# EAGLE design CurrentSensor (EAGLE 9.3.2)
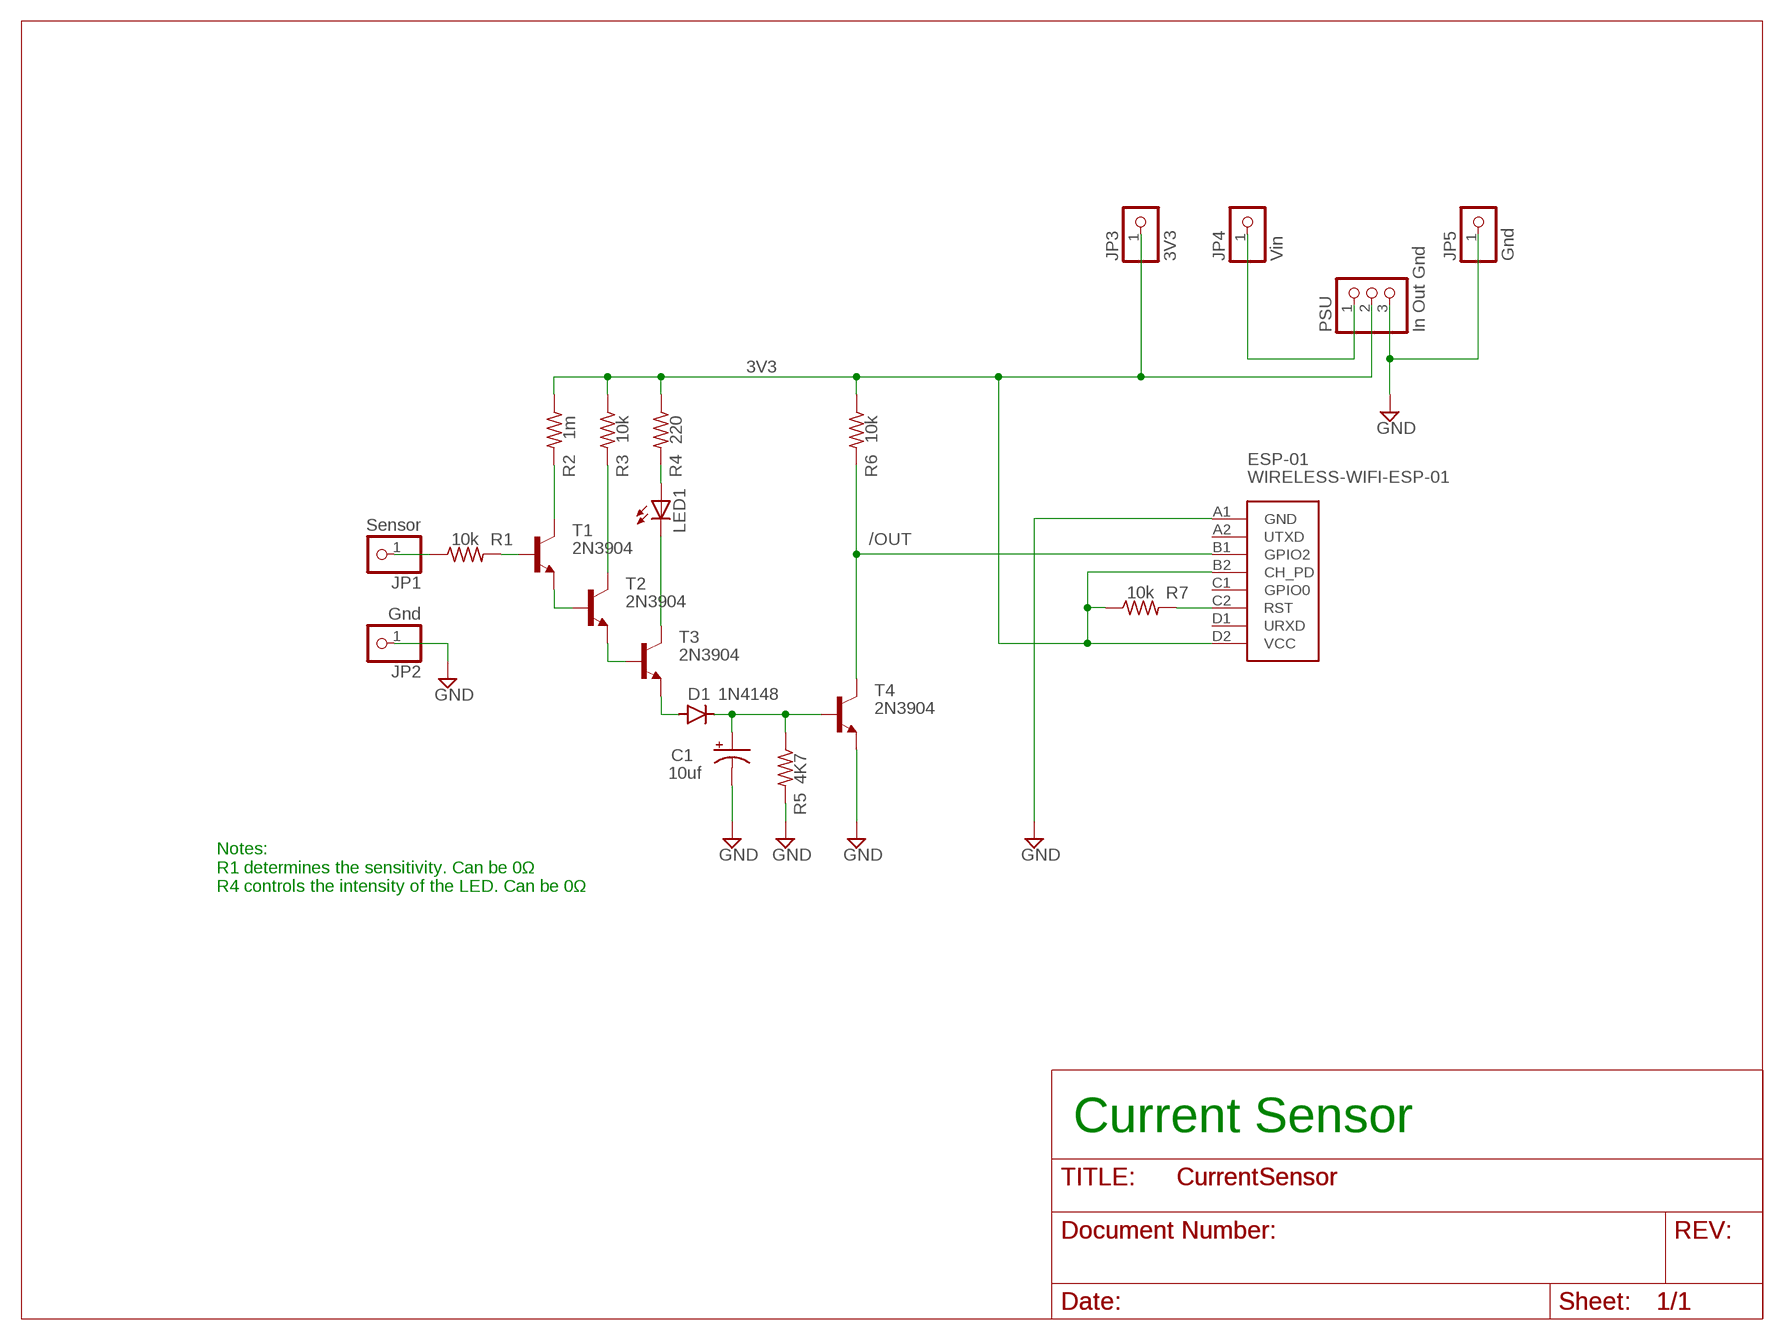
[diagram p0: schematic, sheet 1]

## Parts
C1  10uf  CPOL-USE15-5AXIAL  [E15-5]
D1  1N4148  1N4148DO35-10  [DO35-10]
ESP-01  WIRELESS-WIFI-ESP-01  [WIRELESS-WIFI-ESP-01]
JP1  Sensor  PINHD-1X1  [1X01]
JP2  Gnd  PINHD-1X1  [1X01]
JP3  3V3  PINHD-1X1CB  [1X01-CLEANBIG]
JP4  Vin  PINHD-1X1CB  [1X01-CLEANBIG]
JP5  Gnd  PINHD-1X1CB  [1X01-CLEANBIG]
LED1  LED5MM  [LED5MM]
PSU  In Out Gnd  PINHD-1X3CB  [1X03-CLEANBIG]
R1  10k  R-US_0207/9  [0207/9]
R2  1m  R-US_0207/9  [0207/9]
R3  10k  R-US_0207/9  [0207/9]
R4  220  R-US_0207/9  [0207/9]
R5  4K7  R-US_0207/9  [0207/9]
R6  10k  R-US_0207/9  [0207/9]
R7  10k  R-US_0207/9  [0207/9]
T1  2N3904  [TO92]
T2  2N3904  [TO92]
T3  2N3904  [TO92]
T4  2N3904  [TO92]

## Nets
3V3: ESP-01.B2(CH_PD) ESP-01.D2(VCC) JP3.1 PSU.2 R2.1 R3.1 R4.1 R6.1 R7.1
/OUT: ESP-01.B1(GPIO2) R6.2 T4.1(C)
GND: C1.- ESP-01.A1(GND) JP2.1 JP5.1 PSU.3 R5.2 T4.3(E)
N$1: JP4.1 PSU.1
N$3: JP1.1 R1.1
N$5: T1.3(E) T2.2(B)
N$8: T2.3(E) T3.2(B)
N$9: D1.A T3.3(E)
N$10: C1.+ D1.C R5.1 T4.2(B)
N$11: LED1.K(C) T3.1(C)
N$12: LED1.A R4.2
N$13: R3.2 T2.1(C)
N$14: R2.2 T1.1(C)
N$15: R1.2 T1.2(B)
N$17: ESP-01.C2(RST) R7.2
Unconnected: ESP-01.A2(UTXD) ESP-01.C1(GPIO0) ESP-01.D1(URXD)

## Notes on the sheet
- Notes:
  R1 determines the sensitivity. Can be 0Ω
  R4 controls the intensity of the LED. Can be 0Ω
- Current Sensor

## Library data of the parts
C1 = adafruit:CPOL-US: POLARIZED CAPACITOR, American symbol
D1 = diode:1N4148: DIODE high speed (Philips)
ESP-01 = myParts:WIRELESS-WIFI-ESP-01: Wireless Wi-Fi ESP-01 Module based on ESP8266 chip Click here to find device on ebay.com <http://www.ebay.com/sch/esp8266+esp+01+transceiver>
JP1-JP5 = adafruit:PINHD-1X1: Pin header 1x1 for 0.1" spacing With round pins
LED1 = adafruit:LED: LED OSRAM: - CHIPLED LG R971, LG N971, LY N971, LG Q971, LY Q971, LO R971, LY R971 LH N974, LH R974 LS Q976, LO Q976, LY Q976 LO Q996 - Hyper CHIPLED LW Q18S LB Q993, LB Q99A, LB R99A - SideLED LS A670, LO A670, LY A670, LG A670, LP A670 LB A673, LV A673, LT A673, LW A673 LH A674 LY A675 LS A676, LA A676, LO A676, LY A676, LW A676 LS A679, LY A679, LG A679 - Hyper Micro SIDELED® LS Y876, LA Y876, LO Y876, LY Y876 LT Y87S - SmartLED LW L88C, LW L88S LB L89C, LB L89S, LG L890 LS L89K, LO L89K, LY L89K LS L896, LA L896, LO L896, LY L896 - TOPLED LS T670, LO T670, LY T670, LG T670, LP T670 LSG T670, LSP T670, LSY T670, LOP T670, LYG T670 LG T671, LOG T671, LSG T671 LB T673, LV T673, LT T673, LW T673 LH T674 LS T676, LA T676, LO T676, LY T676, LB T676, LH T676, LSB T676, LW T676 LB T67C, LV T67C, LT T67C, LS T67K, LO T67K, LY T67K, LW E67C LS E67B, LA E67B, LO E67B, LY E67B, LB E67C, LV E67C, LT E67C LW T67C LS T679, LY T679, LG T679 LS T770, LO T770, LY T770, LG T770, LP T770 LB T773, LV T773, LT T773, LW T773 LH T774 LS E675, LA E675, LY E675, LS T675 LS T776, LA T776, LO T776, LY T776, LB T776 LHGB T686 LT T68C, LB T68C - Hyper Mini TOPLED® LB M676 - Mini TOPLED Santana® LG M470 LS M47K, LO M47K, LY M47K Source: http://www.osram.convergy.de/
PSU = adafruit:PINHD-1X3: PIN HEADER
R1-R7 = adafruit:R-US_: RESISTOR, American symbol
T1-T4 = transistor:2N3904: NPN TRANSISTOR

## Board
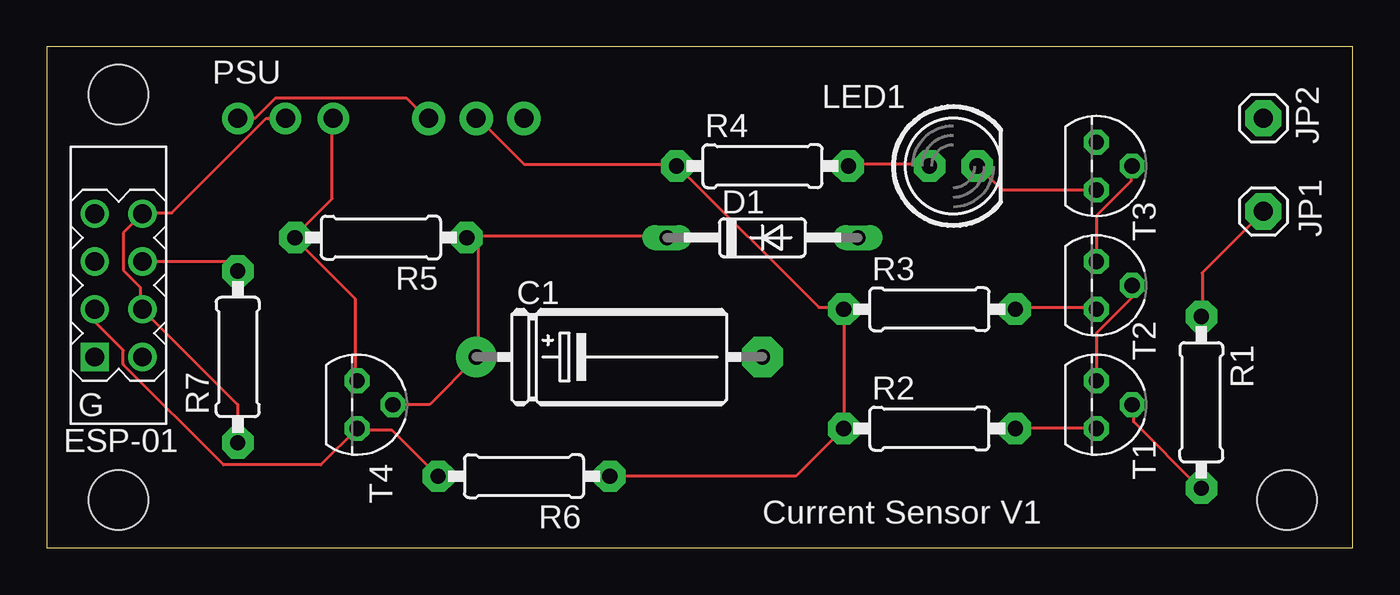
[diagram p1: board, top side]
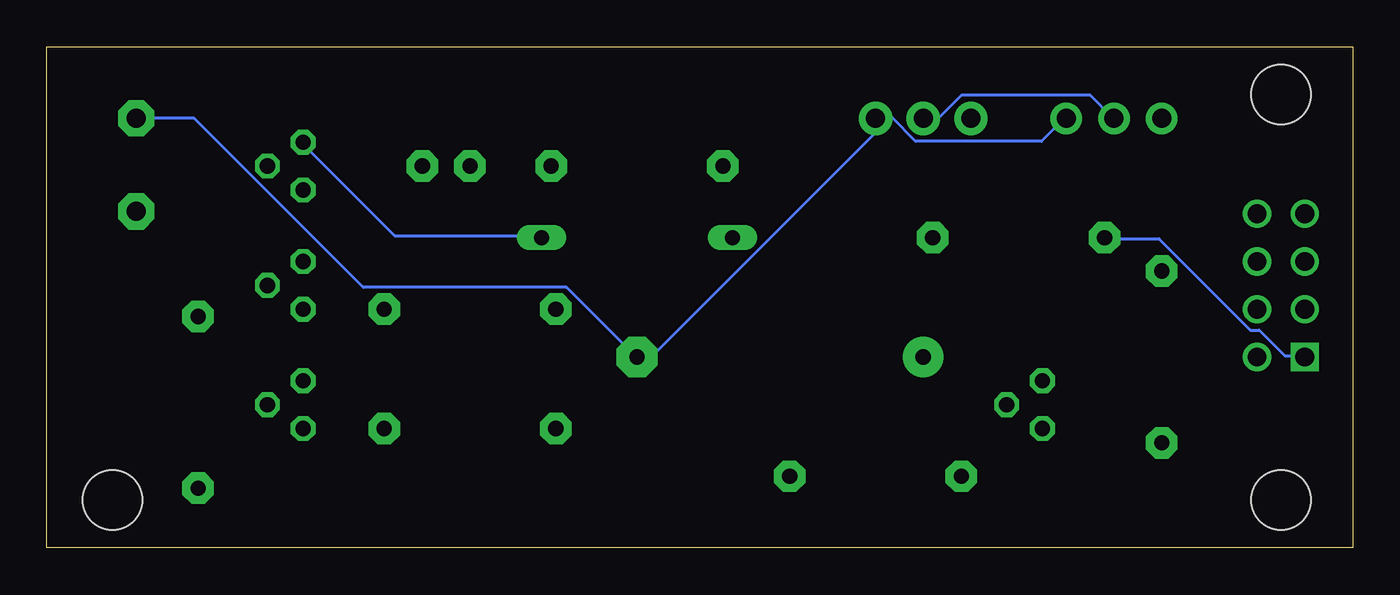
[diagram p2: board, bottom side, seen from below]

Size 69.52 x 26.66 mm. Coordinates in mm from the lower left corner, seen from the top.
Outline: 0,0 69.52,0 69.52,26.66 0,26.66 0,0
Copper layers (1*16): Top 0.035mm / dielectric 1.5mm / Bottom 0.035mm
Design rules "default": minimum track width 6mil, minimum drill 0.35mm, track to track 6mil, track to pad 6mil, pad to pad 6mil, via to via 6mil, smd to smd 6mil, copper to edge 40mil, drill to drill 6mil, minimum pad ring 10mil, minimum via ring 8mil, stop-mask expansion 4mil, vias tented up to drill 0mil, thermal gap 10mil
Holes 3.17 mm at 3.81,24.13 3.81,2.54 66.04,2.54

### Footprints (pad centres in the part's own frame; a part is rotated, then mirrored left to right if it is on the bottom)
E15-5 = drill 0.813 pad 2.159: + -7.62,0 | drill 0.813 pad 2.159 octagon: - 7.62,0
DO35-10 = drill 0.813 long: A 5.08,0; C -5.08,0
WIRELESS-WIFI-ESP-01 = drill 1 square: A1 1.27,3.81 | drill 1: A2 -1.27,3.81; B1 1.27,1.27; B2 -1.27,1.27; C1 1.27,-1.27; C2 -1.27,-1.27; D1 1.27,-3.81; D2 -1.27,-3.81
1X01 = drill 1.016 pad 1.93 octagon: 1 0,0
1X01-CLEANBIG = drill 1.016 pad 1.778: 1 0,0
LED5MM = drill 0.813 pad 1.676 octagon: A -1.27,0; K 1.27,0
1X03-CLEANBIG = drill 1.016 pad 1.676: 1 -2.54,0; 2 0,0; 3 2.54,0
0207/9 = drill 0.813 pad 1.676 octagon: 1 -4.572,0; 2 4.572,0
TO92 = drill 0.813 octagon: 1 1.27,0; 2 0,1.905; 3 -1.27,0

### Placement (x,y rotation side)
C1  30.48,10.16 0 top
D1  38.1,16.51 0 top
ESP-01  3.81,13.97 180 top
JP1  64.77,17.91 0 top
JP2  64.77,22.86 0 top
JP3  22.86,22.86 0 top
JP4  20.32,22.86 0 top
JP5  25.4,22.86 0 top
LED1  48.26,20.32 0 top
PSU  12.7,22.86 0 top
R1  61.47,7.75 270 top
R2  46.99,6.35 0 top
R3  46.99,12.7 0 top
R4  38.1,20.32 0 top
R5  17.78,16.51 180 top
R6  25.4,3.81 180 top
R7  10.16,10.16 90 top
T1  55.88,7.62 270 top
T2  55.88,13.97 270 top
T3  55.88,20.32 270 top
T4  16.51,7.62 270 top

### Tracks (layer width: path | path; a pad name or v marks a point on that pad's centre or on a via)
3V3
  Top 0.152: R6.1 39.88,3.81 R2.1 42.47,6.4 42.47,12.65 R3.1 42.32,12.8 41.1,12.8 33.63,20.27 R4.1 33.48,20.42 25.4,20.42 22.96,22.86 JP3.1 | R7.1 10.16,7.62 ESP-01.B2 4.98,12.8 4.98,13.87 4.06,14.78 4.06,16.76 ESP-01.D2 5.13,17.83 6.66,17.83 11.68,22.86 PSU.2
  Bottom 0.152: JP3.1 22.05,22.86 20.83,24.08 13.97,24.08 12.75,22.86 PSU.2
/OUT
  Top 0.152: R6.2 18.39,6.25 16.56,6.25 T4.1 14.58,4.42 9.4,4.42 4.06,9.75 4.06,10.52 2.54,12.04 ESP-01.B1
GND
  Top 0.152: T4.3 16.41,8.99 16.41,13.26 13.21,16.46 R5.2 13.21,16.61 15.19,18.59 15.19,22.86 PSU.3
  Bottom 0.152: ESP-01.A1 2.54,10.21 3.61,10.21 4.98,11.58 5.44,11.58 10.31,16.46 13.21,16.46 R5.2 | PSU.3 15.34,22.86 16.56,21.64 23.27,21.64 24.49,22.86 JP5.1 25.4,22.1 37.29,10.21 38.05,10.21 C1.- 38.2,10.21 41.86,13.87 52.68,13.87 61.67,22.86 JP2.1
N$1
  Top 0.152: PSU.1 11.07,22.86 12.14,23.93 19.15,23.93 20.22,22.86 JP4.1
N$3
  Top 0.152: R1.1 61.52,12.34 61.52,14.63 64.72,17.83 JP1.1
N$5
  Top 0.152: T1.3 55.88,11.43 57.71,13.26 57.71,13.87 T2.2
N$8
  Top 0.152: T2.3 55.88,17.68 57.71,19.51 57.71,20.27 T3.2
N$9
  Bottom 0.152: D1.A 43.23,16.61 51,16.61 55.88,21.49 T3.3
N$10
  Top 0.152: T4.2 20.37,7.62 22.81,10.06 C1.+ 22.96,10.21 22.96,16.61 | 22.96,16.61 22.35,16.61 R5.1 22.96,16.61 | 22.96,16.61 33.02,16.61 D1.C
N$11
  Top 0.152: T3.1 50.85,19.05 49.63,20.27 LED1.K
N$12
  Top 0.152: R4.2 42.77,20.42 46.89,20.42 LED1.A
N$13
  Top 0.152: T2.1 55.88,12.8 51.61,12.8 R3.2
N$14
  Top 0.152: T1.1 55.88,6.4 51.61,6.4 R2.2
N$15
  Top 0.152: T1.2 57.86,7.62 57.86,6.71 61.37,3.2 R1.2
N$17
  Top 0.152: ESP-01.C2 9.7,15.24 10.16,14.78 R7.2

### Text on the board
tNames: Current Sensor V1